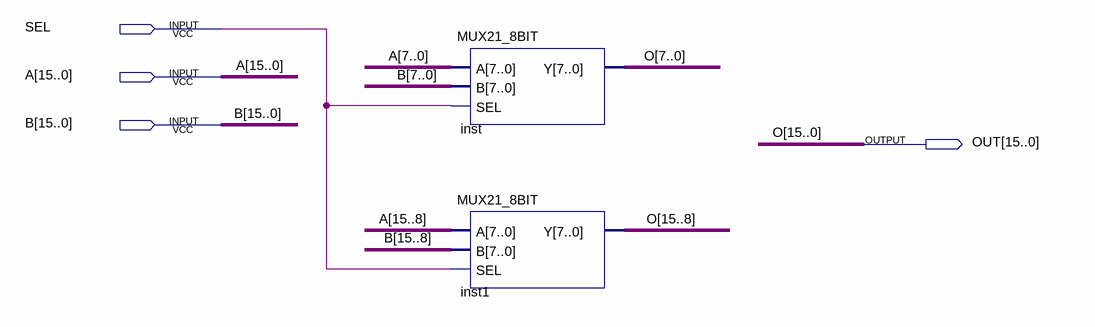
[diagram p0: schematic sheet]
// Quartus schematic MUX21_16BIT.bdf as structural Verilog: 2 symbols, 4 pins
module MUX21_16BIT (
  input  SEL,
  input  [15:0] A,
  input  [15:0] B,
  output [15:0] OUT
);

  MUX21_8BIT inst (.A(A[7:0]), .B(B[7:0]), .SEL(SEL), .Y(OUT[7:0]));
  MUX21_8BIT inst1 (.A(A[15:8]), .B(B[15:8]), .SEL(SEL), .Y(OUT[15:8]));

  // Other names for the same wires on the sheet: O[15:0] = OUT
endmodule
